# EAGLE design blink1micro-programming-jig2 (EAGLE 9.1.3)
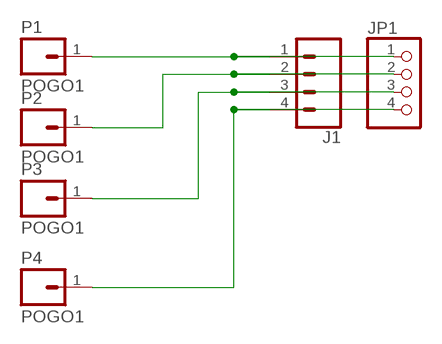
[diagram p0: schematic, sheet 1]

## Parts
J1  CONN_04  [1X04]
JP1  PINHD-1X4/90  [1X04/90]
P1  POGO1  [MILLMAX-0928-POGO-THRU]
P2  POGO1  [MILLMAX-0928-POGO-THRU]
P3  POGO1  [MILLMAX-0928-POGO-THRU]
P4  POGO1  [MILLMAX-0928-POGO-THRU]

## Nets
N$1: J1.1 JP1.1 P1.1
N$2: J1.2 JP1.2 P2.1
N$3: J1.3 JP1.3 P3.1
N$4: J1.4 JP1.4 P4.1

## Library data of the parts
J1 = SparkFun-Connectors:CONN_04: Multi connection point. Often used as Generic Header-pin footprint for 0.1 inch spaced/style header connections On any of the 0.1 inch spaced packages, you can populate with these: Break Away Headers - Straight <https://www.sparkfun.com/products/116> (PRT-00116) Break Away Male Headers - Right Angle <https://www.sparkfun.com/products/553> (PRT-00553) Female Headers <https://www.sparkfun.com/products/115> (PRT-00115) Break Away Headers - Machine Pin <https://www.sparkfun.com/products/117> (PRT-00117) Break Away Female Headers - Swiss Machine Pin <https://www.sparkfun.com/products/743> (PRT-00743) For SCREWTERMINALS and SPRING TERMINALS visit here: Screw Terimnals on SparkFun.com <https://www.sparkfun.com/search/results?term=Screw+Terminals> (5mm/3.5mm/2.54mm spacing) This device is also useful as a general connection point to wire up your design to another part of your project. Our various solder wires solder well into these plated through hole pads. Hook-Up Wire - Assortment (Stranded, 22 AWG) <https://www.sparkfun.com/products/11375> (PRT-11375) Hook-Up Wire - Assortment (Solid Core, 22 AWG) <https://www.sparkfun.com/products/11367> (PRT-11367) View the entire wire category on our website here <https://www.sparkfun.com/categories/141> Special notes: Molex polarized connector foot print use with SKU : PRT-08231 with associated crimp pins and housings. 1MM SMD Version SKU: PRT-10208; PROD_ID: CONN-09696
JP1 = pinhead:PINHD-1X4: PIN HEADER
P1-P4 = todstuff:POGO1

## Board
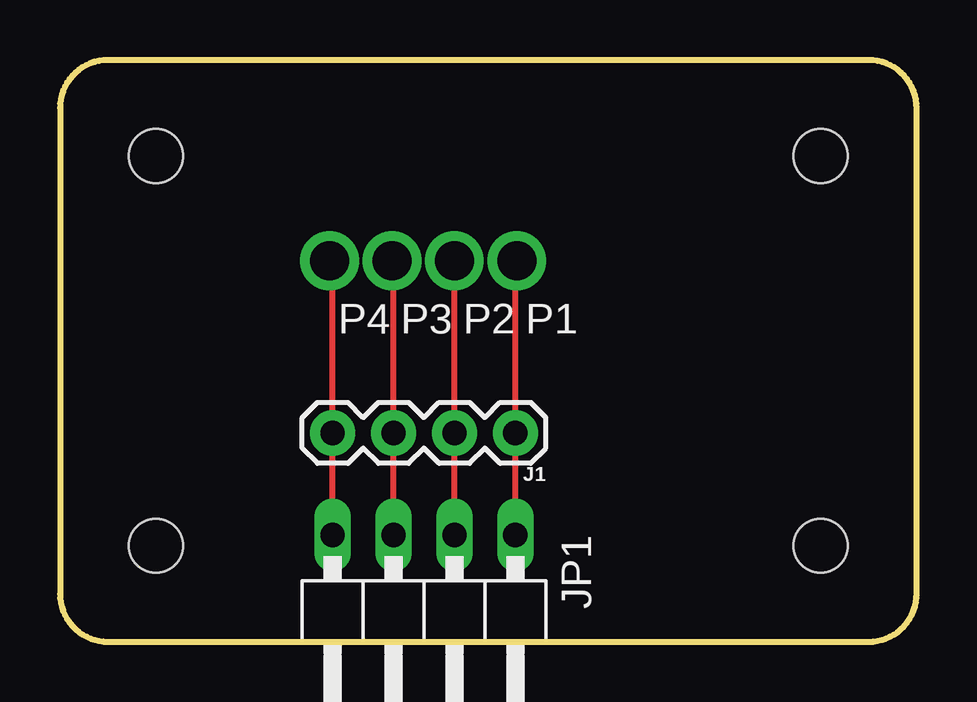
[diagram p1: board, top side]

Size 35.72 x 24.24 mm. Coordinates in mm from the lower left corner, seen from the top.
Outline: 35.72,2 35.72,22.24 arc90 33.72,24.24 2,24.24 arc90 0,22.24 0,2 arc90 2,0 33.72,0 arc90 35.72,2
Copper layers (1*16): Top 0.035mm / dielectric 1.5mm / Bottom 0.035mm
Design rules "default *": minimum track width 6mil, minimum drill 0.35mm, track to track 6mil, track to pad 6mil, pad to pad 6mil, via to via 6mil, smd to smd 6mil, copper to edge 40mil, drill to drill 6mil, minimum pad ring 10mil, minimum via ring 8mil, stop-mask expansion 4mil, vias tented up to drill 0mil, thermal gap 10mil
Holes 2.25 mm at 31.72,4 4,20.24 31.72,20.24 4,4

### Footprints (pad centres in the part's own frame; a part is rotated, then mirrored left to right if it is on the bottom)
1X04 = drill 1.016 pad 1.88: 1 0,0; 2 2.54,0; 3 5.08,0; 4 7.62,0
1X04/90 = drill 1.016 long: 1 -3.81,-3.81; 2 -1.27,-3.81; 3 1.27,-3.81; 4 3.81,-3.81
MILLMAX-0928-POGO-THRU = drill 1.626 pad 2.184: 1 0,0

### Placement (x,y rotation side)
J1  18.99,8.7 180 top
JP1  15.18,0.64 180 top
P1  19.05,15.88 180 top
P2  16.45,15.88 180 top
P3  13.84,15.88 180 top
P4  11.24,15.88 180 top

### Tracks (layer width: path | path; a pad name or v marks a point on that pad's centre or on a via)
N$1
  Top 0.254: JP1.1 J1.1 18.99,15.81 P1.1
N$2
  Top 0.254: JP1.2 J1.2 P2.1
N$3
  Top 0.254: JP1.3 J1.3 13.91,15.81 P3.1
N$4
  Top 0.254: JP1.4 J1.4 11.37,15.75 P4.1